# Altium schematic sheet Accelerometer.SchDoc
size A4; SheetNumber: 6; SheetTotal: 6
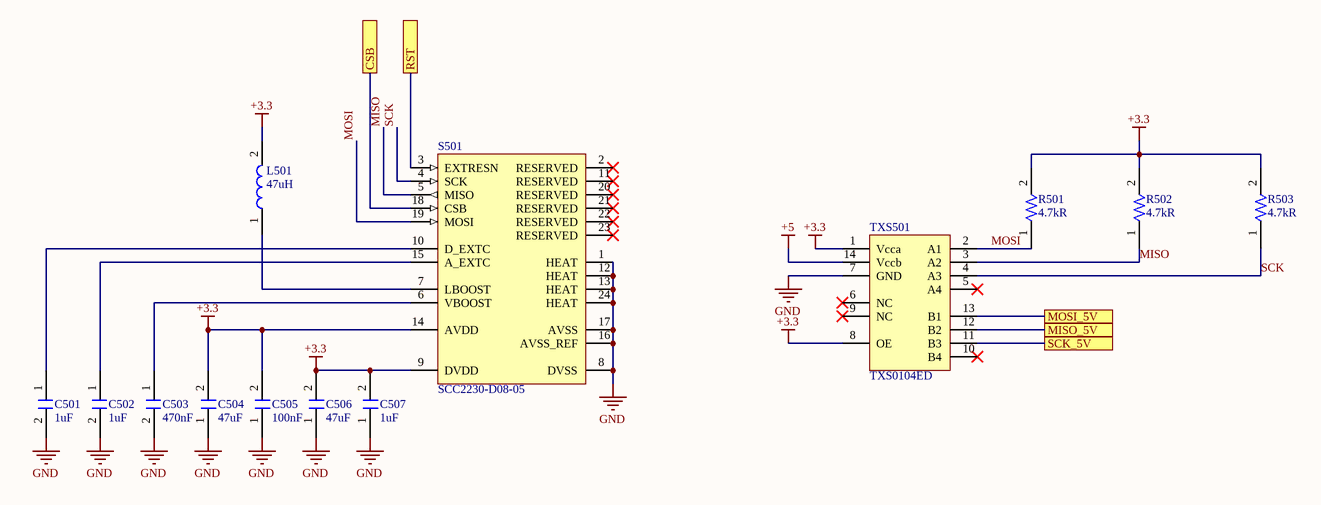
[diagram p0: Accelerometer.SchDoc]

## Parts
C501  Capacitance: 1uF  [C1206FNPC-RW]  (hidden comment: 885012208036)
C502  Capacitance: 1uF  [C1206FNPC-RW]  (hidden comment: 885012208036)
C503  Capacitance: 470nF  [C1206FNPC-RW]  (hidden comment: 885012208011)
C504  Capacitance: 47uF  [C1206FNPC-RW]  (hidden comment: 885012108012)
C505  Capacitance: 100nF  [C1206FNPC-RW]  (hidden comment: 885012208009)
C506  Capacitance: 47uF  [C1206FNPC-RW]  (hidden comment: 885012108012)
C507  Capacitance: 1uF  [C1206FNPC-RW]  (hidden comment: 885012208036)
L501  Inductance: 47uH  [L47u-60mA_CF]  (hidden comment: 744764147)
R501  Resistance: 4.7kR  [R1206FTK-W]  (hidden comment: CRS1206-FX-4701ELF)
R502  Resistance: 4.7kR  [R1206FTK-W]  (hidden comment: CRS1206-FX-4701ELF)
R503  Resistance: 4.7kR  [R1206FTK-W]  (hidden comment: CRS1206-FX-4701ELF)
S501  Manufacturer Part Number 1: SCC2230-D08-05  [Accel_SCC2230-D08]  (hidden comment: SCC2230-D08)
TXS501  Manufacturer Part Number 1: TXS0104ED  [4bitBVL_TXS0104E]  (hidden comment: TXS0104E)

## Ports
CSB, MISO_5V, MOSI_5V, RST, SCK_5V

## Nets
+3.3: C504.2 C505.2 C506.2 C507.2 L501.2 R501.2 R502.2 R503.2 S501.9(DVDD) S501.14(AVDD) TXS501.1(Vcca) TXS501.8(OE)
+5: TXS501.14(Vccb)
GND: C501.2 C502.2 C503.2 C504.1 C505.1 C506.1 C507.1 S501.1(HEAT) S501.8(DVSS) S501.12(HEAT) S501.13(HEAT) S501.16(AVSS_REF) S501.17(AVSS) S501.24(HEAT) TXS501.7(GND)
CSB: S501.18(CSB) ; port CSB
MISO: R502.1 S501.5(MISO) TXS501.3(A2)
MISO_5V: TXS501.12(B2) ; port MISO_5V
MOSI: R501.1 S501.19(MOSI) TXS501.2(A1)
MOSI_5V: TXS501.13(B1) ; port MOSI_5V
RST: S501.3(EXTRESN) ; port RST
SCK: R503.1 S501.4(SCK) TXS501.4(A3)
SCK_5V: TXS501.11(B3) ; port SCK_5V
NetC501_1: C501.1 S501.10(D_EXTC)
NetC502_1: C502.1 S501.15(A_EXTC)
NetC503_1: C503.1 S501.6(VBOOST)
NetL501_1: L501.1 S501.7(LBOOST)

Not connected (* = marked no-connect by the designer): S501 2(RESERVED)* 11(RESERVED)* 20(RESERVED)* 21(RESERVED)* 22(RESERVED)* 23(RESERVED)*; TXS501 5(A4)* 6(NC)* 9(NC)* 10(B4)*

## Library data of the parts
C501 C502 C507 = C1u-16V-1206FNPC-X7R: Cap Cer 1UF 16V X7R 1206; Manufacturer: Wurth Electronics; Tolerance: 10%; Category: Capacitor; ComponentLink1Description: Datasheet; ComponentLink1URL: https://www.we-online.com/catalog/datasheet/885012208036.pdf; ComponentLink2Description: Where buy it; ComponentLink2URL: https://www.we-online.com/catalog/en/WCAP-CSGP-16VDC#885012208036; Supplier 1: Mouser; Manufacturer Part Number: 885012208036; RoHS: Yes; Stock 1: 5938; Pricing 1: 1=0,15000, 10=0,13900, 50=0,13900, 100=0,12400, 500=0,11000, 1000=0,11000, 3000=0,09100, 10000=0,09100 (USD); Mount: Surface Mount; Case/Package: 1206; Case Code (Metric): 3216; Case Code (Imperial): 1206; Min Operating Temperature: -55°C; Max Operating Temperature: 125°C; Packaging: Tape and Reel; Voltage Rating: 16V; Length: 0.126inch; Width: 0.063inch; Thickness: 0.051inch; RoHS Compliant: Yes; Supplier Part Number 1: 710-885012208036
C503 = C470n-10V-1206FNPC-X7R: Cap, 0.47ΜF, 10V, 10%, X7R, 1206; Manufacturer 1: Wurth Electronics; Supplier 1: Digi-Key; Manufacturer Part Number 1: 885012208011; RoHS: Yes; Category: Ceramic Capacitors; Stock 1: 1142; Pricing 1: 1=0,20000, 10=0,17700, 100=0,15900, 500=0,14000 (USD); Mount: Surface Mount; Case/Package: 1206; Case Code (Metric): 3216; Case Code (Imperial): 1206; Min Operating Temperature: -55°C; Max Operating Temperature: 125°C; Packaging: Tape and Reel; Voltage Rating: 10V; Tolerance: 10%; Length: 0.126inch; Width: 0.063inch; Thickness: 0.051inch; RoHS Compliant: Yes; ComponentLink1URL: http://www.farnell.com/datasheets/2546926.pdf?src-supplier=Farnell; ComponentLink1Description: http://www.farnell.com/datasheets/2546926.pdf?src-supplier=Farnell; ComponentLink2URL: https://katalog.we-online.de/pbs/datasheet/885012208011.pdf?src-supplier=Digi-Key; ComponentLink2Description: https://katalog.we-online.de/pbs/datasheet/885012208011.pdf?src-supplier=Digi-Key; Supplier Part Number 1: 732-7683-1-ND; ComponentLink3Description: Wurth Elektronik; ComponentLink3URL: https://www.we-online.com/catalog/en/WCAP-CSGP-10VDC?sq=885012208011#885012208011
C504 C506 = C47u-10V-1206FNPC-X5R: Multilayer Ceramic Capacitor, Wcap-Csgp Series, 47 F, 20%, X5r, 10 V, 1206 [3216 Metric]; Manufacturer 1: Wurth Electronics; Voltage Rating: 10V; Supplier 1: Digi-Key; Manufacturer Part Number 1: 885012108012; RoHS: Yes; Category: Ceramic Capacitors; Stock 1: 2003; Pricing 1: 1=1,26000, 10=1,14000, 100=1,02200, 500=0,90400 (USD); Mount: Surface Mount; Case/Package: 1206; Case Code (Metric): 3216; Case Code (Imperial): 1206; Min Operating Temperature: -55°C; Max Operating Temperature: 85°C; Packaging: Cut Tape; Dielectric: X5R; Tolerance: 20%; Voltage Rating (DC): 10V; Length: 0.126inch; Width: 0.063inch; Thickness: 0.075inch; REACH SVHC: Unknown; RoHS Compliant: Yes; ComponentLink1URL: http://www.farnell.com/datasheets/1958457.pdf?src-supplier=Farnell; ComponentLink1Description: http://www.farnell.com/datasheets/1958457.pdf?src-supplier=Farnell; ComponentLink2URL: https://katalog.we-online.de/pbs/datasheet/885012108012.pdf?src-supplier=Digi-Key; ComponentLink2Description: https://katalog.we-online.de/pbs/datasheet/885012108012.pdf?src-supplier=Digi-Key; ComponentLink3URL: http://www.farnell.com/datasheets/1958457.pdf?src-supplier=Element14; ComponentLink3Description: http://www.farnell.com/datasheets/1958457.pdf?src-supplier=Element14; Supplier Part Number 1: 732-7638-1-ND; ComponentLink4Description: Wurth Elektronik; ComponentLink4URL: https://www.we-online.com/catalog/en/WCAP-CSGP-10VDC?sq=885012108012#885012108012
C505 = C100n-10V-1206FNPC-X7R: Cap, 0.1ΜF, 10V, 10%, X7R, 1206; Manufacturer 1: Wurth Electronics; Supplier 1: Digi-Key; Manufacturer Part Number 1: 885012208009; RoHS: Yes; Category: Ceramic Capacitors; Stock 1: 7198; Pricing 1: 1=0,11000, 10=0,10300, 100=0,09200, 500=0,08100 (USD); Mount: Surface Mount; Case/Package: 1206; Case Code (Metric): 3216; Case Code (Imperial): 1206; Min Operating Temperature: -55°C; Max Operating Temperature: 125°C; Packaging: Tape and Reel; Voltage Rating: 10V; Tolerance: 10%; Length: 0.126inch; Width: 0.063inch; Thickness: 0.035inch; RoHS Compliant: Yes; ComponentLink1URL: http://www.farnell.com/datasheets/2031891.pdf?src-supplier=Farnell; ComponentLink1Description: http://www.farnell.com/datasheets/2031891.pdf?src-supplier=Farnell; ComponentLink2URL: http://katalog.we-online.de/pbs/datasheet/885012208009.pdf?src-supplier=Digi-Key; ComponentLink2Description: http://katalog.we-online.de/pbs/datasheet/885012208009.pdf?src-supplier=Digi-Key; ComponentLink3URL: https://katalog.we-online.de/pbs/datasheet/885012208009.pdf?src-supplier=Digi-Key; ComponentLink3Description: https://katalog.we-online.de/pbs/datasheet/885012208009.pdf?src-supplier=Digi-Key; Supplier Part Number 1: 732-8086-1-ND; ComponentLink4Description: Wurth Elektronik; ComponentLink4URL: https://www.we-online.com/catalog/en/WCAP-CSGP-10VDC?sq=885012208009#885012208009
L501 = L47u-60mA_CF: WE-GF Series; Wire-wound SMD Inductor with Ferrite Core; 47 µH; Manufacturer 1: Wurth Electronics; Tolerance: 10%; Max DC Current: 60mA; DC Resistance (DCR): 7R; Self Resonant Frequency: 15MHz; Supplier 1: Digi-Key; Manufacturer Part Number 1: 744764147; RoHS: Yes; Category: Fixed Inductors; Stock 1: 156; Pricing 1: 1=0,66000, 10=0,59500, 50=0,54800, 100=0,51200, 500=0,46500 (USD); Mount: Surface Mount; Case/Package: 1210; Core Material: Ferrite; Min Operating Temperature: -40°C; Max Operating Temperature: 105°C; Packaging: Cut Tape; Inductance Tolerance: 10%; Series: WE-GF; Length: 3.2mm; Height: 2.2mm; Depth: 2.5mm; REACH SVHC: Unknown; RoHS Compliant: Yes; ComponentLink1URL: https://datasheet.ciiva.com/11801/0900766b802e95df-11801953.pdf?src-supplier=RSComponents; ComponentLink1Description: https://datasheet.ciiva.com/11801/0900766b802e95df-11801953.pdf?src-supplier=RSComponents; Supplier Part Number 1: 732-14034-1-ND; ComponentLink2Description: Wurth Elektronik; ComponentLink2URL: https://www.we-online.com/catalog/en/WE-GF?sq=744764147&sp=https%3A%2F%2Fwww.we-online.com%2Fweb%2Fen%2Fwuerth_elektronik%2Fsearchpage.php%3Fsearch%3D744764147#744764147
R501-R503 = R4.7K-1206FTK: Res Thick Film 1206 4.7K Ohm 1% 1/2W ±100ppm/°C Molded SMD T/R; Manufacturer 1: Bourns JW Miller; Voltage Rating: 400V; Power Rating: 500mW; Supplier 1: Digi-Key; RoHS: Yes; Category: Chip SMD Resistors; Pricing 1: 1=0,42000, 10=0,35400, 100=0,13850, 1000=0,05796, 2500=0,05313 (USD); Mount: Surface Mount; Case/Package: 1206; Case Code (Metric): 3016; Case Code (Imperial): 1206; Min Operating Temperature: -55°C; Max Operating Temperature: 155°C; Packaging: Cut Tape; Resistor Type: Thick Film; Number of Terminations: 2; Termination: SMD/SMT; Working Voltage: 400V; Voltage Rating (DC): 400V; Tolerance: 1%; Max Power Dissipation: 500mW; Temperature Coefficient: 100ppm/°C; Length: 0.122inch; Width: 0.063inch; Height: 0.026inch; REACH SVHC: No SVHC; ComponentLink1URL: https://datasheet.ciiva.com/48986/70483705-48986735.pdf?src-supplier=Allied+Electronics; ComponentLink1Description: https://datasheet.ciiva.com/48986/70483705-48986735.pdf?src-supplier=Allied+Electronics; Supplier Part Number 1: CRS1206-FX-4701ELFCT-ND; ComponentLink3Description: RS; ComponentLink3URL: https://es.rs-online.com/web/p/resistencias-de-montaje-en-superficie/8672965; Manufacturer Part Number 1: CRS1206-FX-4701ELF
S501 = Accel_SCC2230-D08: Accelerometer and Gyroscope Digital Output 3.3V 24-Pin SOIC T/R; Manufacturer 1: Murata; Sensor Type: Accelerometer,Gyroscope,3 Axis; Output Type: SPI; Supplier 1: Digi-Key; RoHS: Yes; Category: Inertial Measurement Units (IMUs); Stock 1: 296; Pricing 1: 1=92,29000, 5=87,67600, 10=80,75400, 25=71,52480 (USD); Mount: Surface Mount; Case/Package: SMD/SMT; Min Operating Temperature: -40°C; Max Operating Temperature: 125°C; Packaging: Tape and Reel; RoHS Compliant: Yes; ComponentLink1URL: https://www.murata.com/~/media/webrenewal/products/sensor/gyro/scc2000/scc2230-d08%20datasheet%2082177600b0.ashx?la=en&src-supplier=Digi-Key; ComponentLink1Description: https://www.murata.com/~/media/webrenewal/products/sensor/gyro/scc2000/scc2230-d08%20datasheet%2082177600b0.ashx?la=en&src-supplier=Digi-Key; Supplier Part Number 1: 490-12142-1-ND; ComponentLink2Description: Murata; ComponentLink2URL: https://www.murata.com/en-global/products/productdetail?partno=SCC2230-D08
TXS501 = 4bitBVL_TXS0104E: 4-Bit Bidirectional Voltage-Level Shifter for Open-Drain and Push-Pull Applications 14-SOIC -40 to 85; Manufacturer 1: Texas Instruments; Data Rate: 24Mbps; Number of Channels: 4; Propagation Delay: 260ns; Min Supply Voltage: 1.65V; Max Supply Voltage: 5.5V; Logic Function: Translator; High Level Output Current: -20uA; Low Level Output Current: 1mA; Quiescent Current: 14.4uA; Nominal Supply Current: 12uA; Number of Circuits: 1; Supplier 1: Digi-Key; RoHS: Yes; Category: Voltage Level Shifters; Stock 1: 9570; Pricing 1: 1=1,54000, 10=1,37600, 25=1,30600, 100=1,07270, 250=1,00276, 500=0,88616, 1000=0,77000 (USD); Mount: Surface Mount; Case/Package: SOIC; Number of Pins: 14; Weight: 0.004564oz; Min Operating Temperature: -40°C; Max Operating Temperature: 85°C; Packaging: Rail/Tube; Package Quantity: 50; Number of Bits: 4; Turn-On Delay Time: 260ns; Output Type: Voltage; Series: -; Number of Inputs: 4; Output Current: 1mA; Length: 8.65mm; Width: 3.91mm; Height: 1.58mm; Radiation Hardening: No; Lead Free: Lead Free; RoHS Compliant: Yes; REACH SVHC: No SVHC; ComponentLink1URL: https://datasheet.ciiva.com/1628/txs0104e-1628720.pdf?src-supplier=Newark; ComponentLink1Description: https://datasheet.ciiva.com/1628/txs0104e-1628720.pdf?src-supplier=Newark; ComponentLink2URL: https://datasheet.ciiva.com/15096/getdatasheetpartid-226007-15096240.pdf?src-supplier=Verical; ComponentLink2Description: https://datasheet.ciiva.com/15096/getdatasheetpartid-226007-15096240.pdf?src-supplier=Verical; ComponentLink3URL: https://datasheet.ciiva.com/41455/001017332-da-01-en-ic-4bit-transltr-txs0104ed-soic-14-tid-41455684.pdf?src-supplier=Conrad; ComponentLink3Description: https://datasheet.ciiva.com/41455/001017332-da-01-en-ic-4bit-transltr-txs0104ed-soic-14-tid-41455684.pdf?src-supplier=Conrad; ComponentLink4URL: https://datasheet.ciiva.com/1508/1811230-1508823.pdf?src-supplier=Element14; ComponentLink4Description: https://datasheet.ciiva.com/1508/1811230-1508823.pdf?src-supplier=Element14; ComponentLink5URL: https://datasheet.ciiva.com/6615/txs0104e-6615001.pdf?src-supplier=Digi-Key; ComponentLink5Description: https://datasheet.ciiva.com/6615/txs0104e-6615001.pdf?src-supplier=Digi-Key; Supplier Part Number 1: 296-34699-5-ND; ComponentLink6Description: RS uk; ComponentLink6URL: https://uk.rs-online.com/web/p/translator-ics/9236848